# Altium project 尺子1.PrjPCB
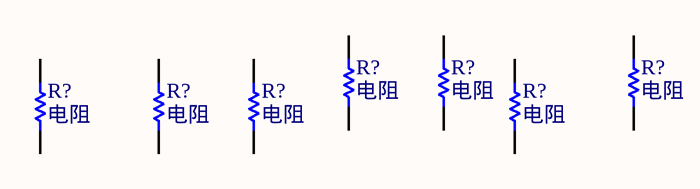
[diagram p0: Sheet1.SchDoc]
1 sheet, 7 parts. Net scope: global (net labels, ports and power ports of the same name join across sheets).
Board files: PCB1.PcbDoc, PCB尺子1.pcbdoc, PCB尺子2.PcbDoc, 尺子V1.0.PcbDoc, 尺子V2.0.PcbDoc

## Sheet Sheet1.SchDoc
size A4

### Parts
(Parts that share a designator on the sheet are numbered #1, #2 ... from top to bottom, then left to right.)
R?#1  电阻  [R1812]
R?#2  电阻  [R2010]
R?#3  电阻  [120603]
R?#4  电阻  [R0402]
R?#5  电阻  [R0603]
R?#6  电阻  [R0805]
R?#7  电阻  [R2512]

### Nets

Not connected (* = marked no-connect by the designer): R?#1 1 2; R?#2 1 2; R?#3 1 2; R?#4 1 2; R?#5 1 2; R?#6 1 2; R?#7 1 2

### Library data of the parts
R?#1-R?#7 = 电阻: Resistor; Value: 150R; Published: 8-Jun-2000; LatestRevisionDate: 17-Jul-2002; LatestRevisionNote: Re-released for DXP Platform.; PackageReference: AXIAL-0.3; Publisher: Altium Limited; PackageDescription: Axial Device, Thru-Hole; 2 Leads; 0.3 in Pin Spacing